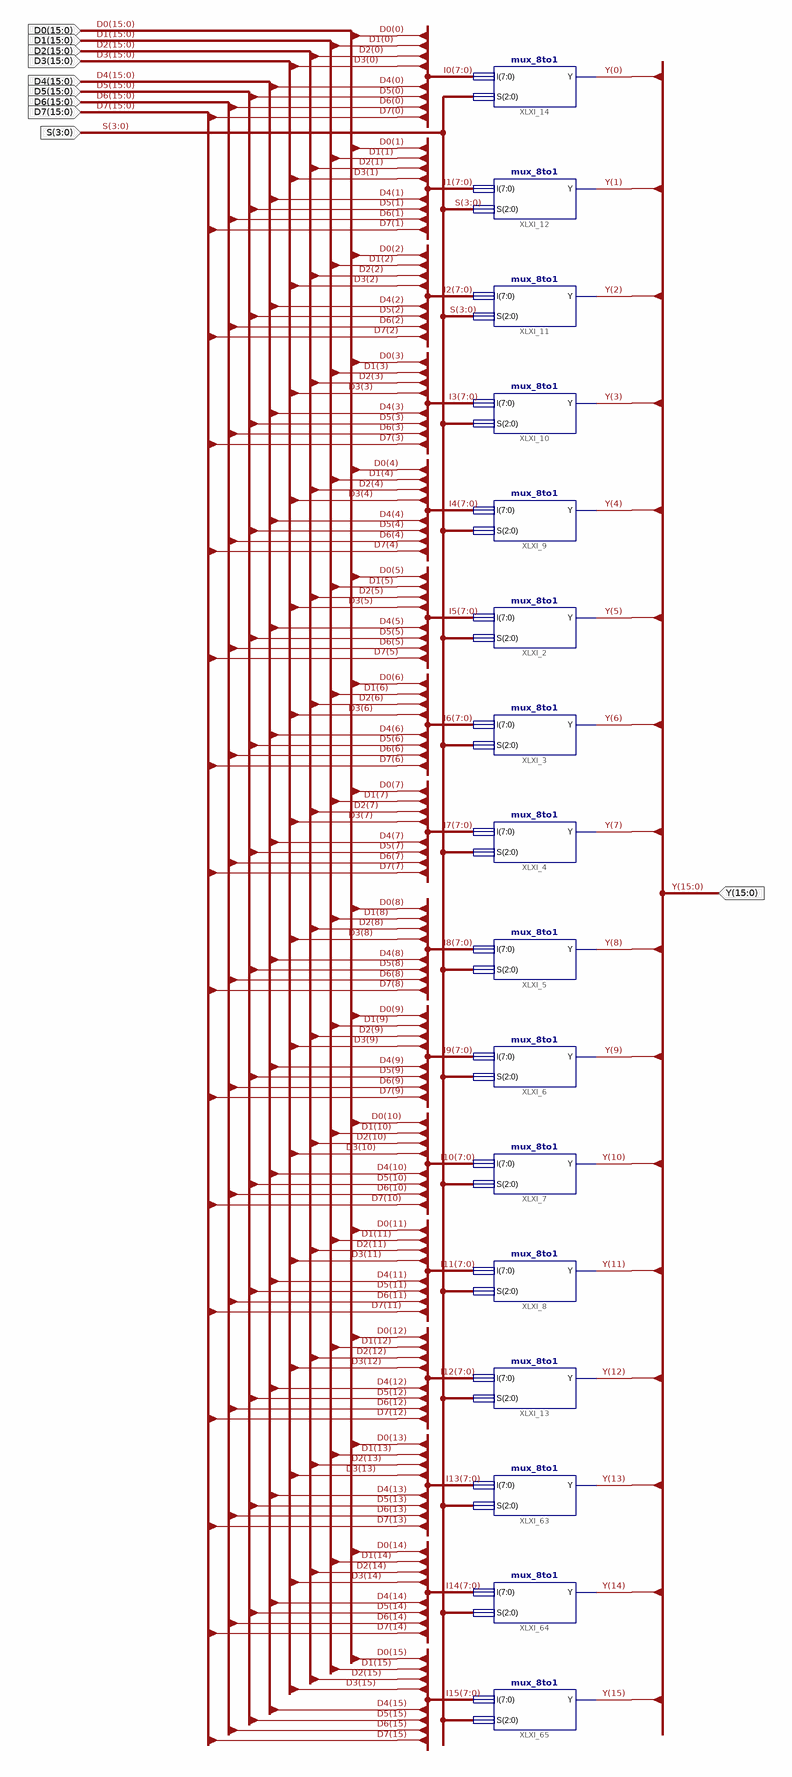
[diagram p0: schematic sheet 1]
// Xilinx ISE schematic mux_16to1.sch (virtex6) as structural Verilog: 16 symbols, 10 ports
module mux_16to1 (
  input  [15:0] D0,
  input  [15:0] Y,
  input  [15:0] D1,
  input  [15:0] D2,
  input  [15:0] D3,
  input  [15:0] D4,
  input  [15:0] D5,
  input  [15:0] D6,
  input  [15:0] D7,
  input  [3:0] S
);

  wire [7:0] I0, I1, I2, I3, I4, I5, I6, I7, I8, I9, I10, I11, I12, I13, I14, I15;

  mux_8to1 XLXI_14 (.Y(Y[0]), .I(I0), .S(S));
  mux_8to1 XLXI_12 (.Y(Y[1]), .I(I1), .S(S));
  mux_8to1 XLXI_11 (.Y(Y[2]), .I(I2), .S(S));
  mux_8to1 XLXI_10 (.Y(Y[3]), .I(I3), .S(S));
  mux_8to1 XLXI_9 (.Y(Y[4]), .I(I4), .S(S));
  mux_8to1 XLXI_2 (.Y(Y[5]), .I(I5), .S(S));
  mux_8to1 XLXI_3 (.Y(Y[6]), .I(I6), .S(S));
  mux_8to1 XLXI_4 (.Y(Y[7]), .I(I7), .S(S));
  mux_8to1 XLXI_5 (.Y(Y[8]), .I(I8), .S(S));
  mux_8to1 XLXI_6 (.Y(Y[9]), .I(I9), .S(S));
  mux_8to1 XLXI_7 (.Y(Y[10]), .I(I10), .S(S));
  mux_8to1 XLXI_8 (.Y(Y[11]), .I(I11), .S(S));
  mux_8to1 XLXI_13 (.Y(Y[12]), .I(I12), .S(S));
  mux_8to1 XLXI_63 (.Y(Y[13]), .I(I13), .S(S));
  mux_8to1 XLXI_64 (.Y(Y[14]), .I(I14), .S(S));
  mux_8to1 XLXI_65 (.Y(Y[15]), .I(I15), .S(S));
endmodule
